# Altium project TD3_TP2_Placa-de-desarrollo.PrjPcb
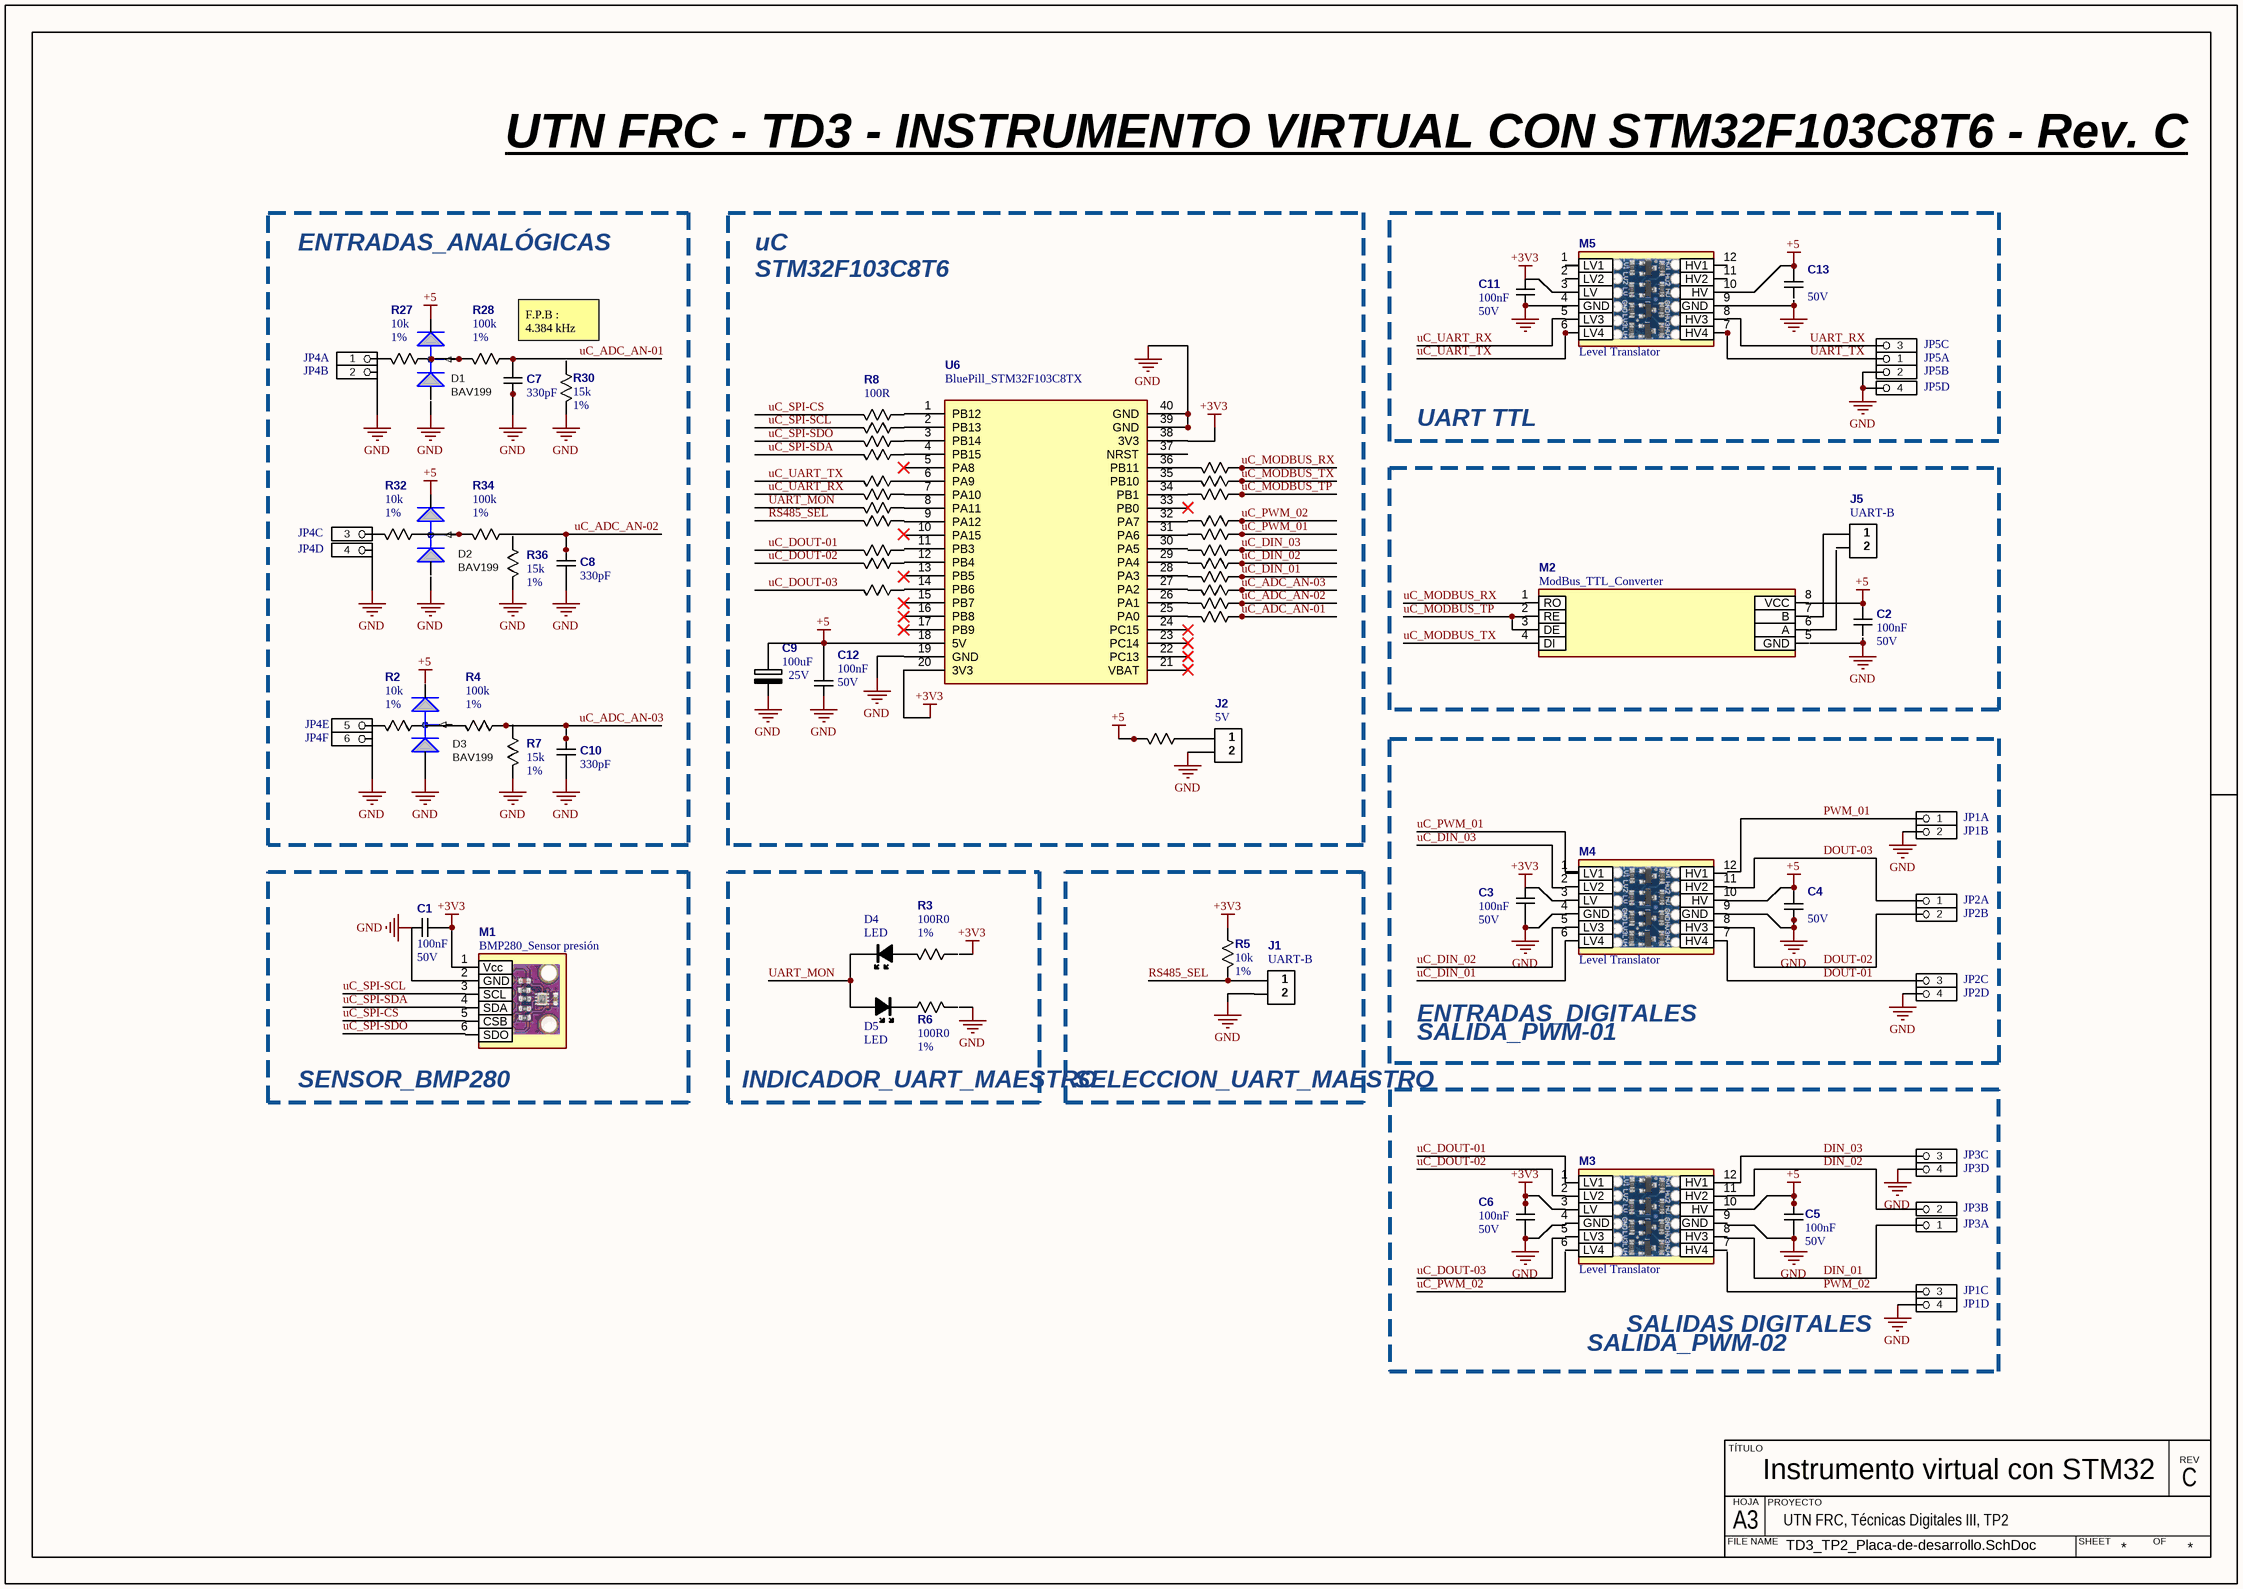
[diagram p0: TD3_TP2_Placa-de-desarrollo.SchDoc]
1 sheet, 67 parts. Net scope: global (net labels, ports and power ports of the same name join across sheets).
Board file: TD3_TP2_Placa-de-desarrollo.PcbDoc

## Sheet TD3_TP2_Placa-de-desarrollo.SchDoc: Instrumento virtual con STM32
size 420 x 297 mm; Revision: C; Proyecto: UTN FRC, Técnicas Digitales III, TP2

### Parts
C1  VALOR: 100nF  TENSION: 50V  [C_0805_RFW]  (hidden comment: Cap No Pol)
C2  VALOR: 100nF  TENSION: 50V  [C_0805_RFW]  (hidden comment: Cap No Pol)
C3  VALOR: 100nF  TENSION: 50V  [C_0805_RFW]  (hidden comment: Cap No Pol)
C4  TENSION: 50V  [C_0805_RFW]  (hidden comment: Cap No Pol)
C5  VALOR: 100nF  TENSION: 50V  [C_0805_RFW]  (hidden comment: Cap No Pol)
C6  VALOR: 100nF  TENSION: 50V  [C_0805_RFW]  (hidden comment: Cap No Pol)
C7  330pF  [C_0805_RFW]
C8  330pF  [C_0805_RFW]
C9  CAPACIDAD: 100uF  TENSION: 25V  [CAP_ELECTR_V_10x12]  (hidden comment: Cap Pol Al)
C10  330pF  [C_0805_RFW]
C11  VALOR: 100nF  TENSION: 50V  [C_0805_RFW]  (hidden comment: Cap No Pol)
C12  VALOR: 100nF  TENSION: 50V  [C_0805_RFW]  (hidden comment: Cap No Pol)
C13  TENSION: 50V  [C_0805_RFW]  (hidden comment: Cap No Pol)
D1  BAV199  [SOT_23_3_1_RFW]
D2  BAV199  [SOT_23_3_1_RFW]
D3  BAV199  [SOT_23_3_1_RFW]
D4  LED  [LED_5mm]
D5  LED  [LED_5mm]
J1  UART-B  [HEADER_2_FEMALE_2.54]
J2  5V  [HEADER_2_FEMALE_2.54]
J5  UART-B  [HEADER_2_FEMALE_2.54]
JP1  HEADER PART  [PIN_1X4_MACHO_2.54]  (value not drawn)  (parts A,B,C,D of 4)
JP2  HEADER PART  [PIN_1X4_MACHO_2.54]  (value not drawn)  (parts A,B,C,D of 4)
JP3  HEADER PART  [PIN_1X4_MACHO_2.54]  (value not drawn)  (parts A,B,C,D of 4)
JP4  HEADER PART  [PIN_1X6_MACHO_2.54]  (value not drawn)  (parts A,B,C,D,E,F of 6)
JP5  HEADER PART  [PIN_1X4_MACHO_2.54]  (value not drawn)  (parts A,B,C,D of 4)
M1  BMP280_Sensor presión  [BMP280]
M2  ModBus_TTL_Converter  [TTL_RS485_CONVERTER]
M3  Level Translator  [Level_Translator_FET]
M4  Level Translator  [Level_Translator_FET]
M5  Level Translator  [Level_Translator_FET]
R1  100R  [R_0805_RFW]  (value not drawn)
R2  10k  Tolerancia: 1%  [R_0805_RFW]
R3  100R0  Tolerancia: 1%  [R_0805_RFW]
R4  100k  Tolerancia: 1%  [R_0805_RFW]
R5  10k  Tolerancia: 1%  [R_0805_RFW]
R6  100R0  Tolerancia: 1%  [R_0805_RFW]
R7  15k  Tolerancia: 1%  [R_0805_RFW]
R8  100R  [R_0805_RFW]
R9  100R  [R_0805_RFW]  (value not drawn)
R10  100R  [R_0805_RFW]  (value not drawn)
R11  100R  [R_0805_RFW]  (value not drawn)
R12  100R  [R_0805_RFW]  (value not drawn)
R13  100R  [R_0805_RFW]  (value not drawn)
R14  100R  [R_0805_RFW]  (value not drawn)
R15  100R  [R_0805_RFW]  (value not drawn)
R16  100R  [R_0805_RFW]  (value not drawn)
R17  100R  [R_0805_RFW]  (value not drawn)
R18  100R  [R_0805_RFW]  (value not drawn)
R19  100R  [R_0805_RFW]  (value not drawn)
R20  100R  [R_0805_RFW]  (value not drawn)
R21  100R  [R_0805_RFW]  (value not drawn)
R22  100R  [R_0805_RFW]  (value not drawn)
R23  100R  [R_0805_RFW]  (value not drawn)
R24  100R  [R_0805_RFW]  (value not drawn)
R25  100R  [R_0805_RFW]  (value not drawn)
R26  100R  [R_0805_RFW]  (value not drawn)
R27  10k  Tolerancia: 1%  [R_0805_RFW]
R28  100k  Tolerancia: 1%  [R_0805_RFW]
R29  100R  [R_0805_RFW]  (value not drawn)
R30  15k  Tolerancia: 1%  [R_0805_RFW]
R31  100R  [R_0805_RFW]  (value not drawn)
R32  10k  Tolerancia: 1%  [R_0805_RFW]
R33  100R  [R_0805_RFW]  (value not drawn)
R34  100k  Tolerancia: 1%  [R_0805_RFW]
R36  15k  Tolerancia: 1%  [R_0805_RFW]
U6  BluePill_STM32F103C8TX  [BluePill_STM32F103CTX]

### Blocks framed on the sheet
ENTRADAS_ANALÓGICAS: C7 C8 C10 D1-D3 JP4 R2 R4 R7 R27 R28 R30 R32 R34 R36
UART TTL: C11 C13 JP5 M5
SENSOR_BMP280: C1 M1
INDICADOR_UART_MAESTRO: D4 D5 R3 R6
SELECCION_UART_MAESTRO: J1 R5

### Nets
+3V3: C1.1 C3.2 C6.1 C11.2 M1.1(Vcc) M3.3(LV) M5.3(LV) U6.38(3V3)
+5: C2.1 C4.1 C5.1 C9.1 C12.1 C13.1 D1.2 D2.2 M3.10(HV) M5.10(HV) R33.2
GND: C1.2 C3.1 C4.2 C5.2 C6.2 C7.1 C8.1 C10.1 C11.1 C12.2 D3.1 J1.2 J2.2 JP1.2 JP1.4 JP2.4 JP3.4 JP4.2 JP4.4 JP4.6 JP5.2 JP5.4 M1.2(GND) M4.4(GND) M4.9(GND) M5.4(GND) M5.9(GND) R7.2 R30.2 R36.2 U6.39(GND) U6.40(GND)
DIN_01: JP3.1
DIN_02: JP3.2 M3.11(HV2)
DIN_03: JP3.3 M3.12(HV1)
DOUT-01: JP2.3 M4.7(HV4)
DOUT-02: JP2.2 M4.8(HV3)
DOUT-03: JP2.1
PWM_01: JP1.1
PWM_02: JP1.3
RS485_SEL: J1.1 R5.2 R29.2
UART_MON: D4.K D5.A R31.2
UART_RX: JP5.3 M5.8(HV3)
UART_TX: JP5.1 M5.7(HV4)
uC_ADC_AN-01: C7.2 R25.1 R28.1
uC_ADC_AN-02: C8.2 R24.1 R34.1
uC_ADC_AN-03: C10.2 R1.1 R4.1
uC_DIN_01: M4.6(LV4) R22.1
uC_DIN_02: M4.5(LV3) R21.1
uC_DIN_03: R19.1
uC_DOUT-01: M3.1(LV1) R18.2
uC_DOUT-02: M3.2(LV2) R20.2
uC_DOUT-03: R23.2
uC_MODBUS_RX: M2.1(RO) R12.1
uC_MODBUS_TP: M2.2(RE) M2.3(DE) R26.1
uC_MODBUS_TX: M2.4(DI) R14.1
uC_PWM_01: R17.1
uC_PWM_02: R15.1
uC_SPI-CS: R8.2
uC_SPI-SCL: M1.3(SCL) R9.2
uC_SPI-SDA: R11.2
uC_SPI-SDO: R10.2
uC_UART_RX: M5.5(LV3) R16.2
uC_UART_TX: M5.6(LV4) R13.2
NetJ2_1: J2.1 R33.1
NetJP4_1: JP4.1 R27.2
NetR2_1: R2.1 R4.2
NetR9_1: R9.1 U6.2(PB13)
NetR10_1: R10.1 U6.3(PB14)
NetR11_1: R11.1 U6.4(PB15)
NetR12_2: R12.2 U6.36(PB11)
NetR13_1: R13.1 U6.6(PA9)
NetR14_2: R14.2 U6.35(PB10)
NetR16_1: R16.1 U6.7(PA10)
NetR24_2: R24.2 U6.26(PA1)
NetR25_2: R25.2 U6.25(PA0)
NetR26_2: R26.2 U6.34(PB1)
NetR27_1: R27.1 R28.2
NetR32_1: R32.1 R34.2

Not connected (* = marked no-connect by the designer): C2 2; C9 2; C13 2; D1 1 3; D2 1 3; D3 2 3; D4 A; D5 K; J5 1 2; JP4 3 5; M1 4(SDA) 5(CSB) 6(SDO); M2 5(GND) 6(A) 7(B) 8(VCC); M3 4(GND) 5(LV3) 6(LV4) 7(HV4) 8(HV3) 9(GND); M4 1(LV1) 2(LV2) 3(LV) 10(HV) 11(HV2) 12(HV1); M5 1(LV1) 2(LV2) 11(HV2) 12(HV1); R1 2; R2 2; R3 1 2; R5 1; R6 1 2; R7 1; R8 1; R15 2; R17 2; R18 1; R19 2; R20 1; R21 2; R22 2; R23 1; R29 1; R30 1; R31 1; R32 2; R36 1; U6 1(PB12) 5(PA8) 8(PA11) 9(PA12) 10(PA15) 11(PB3) 12(PB4) 13(PB5) 14(PB6) 15(PB7) 16(PB8) 17(PB9) 18(5V) 19(GND) 20(3V3) 21(VBAT) 22(PC13)* 23(PC14)* 24(PC15)* 27(PA2) 28(PA3) 29(PA4) 30(PA5) 31(PA6) 32(PA7) 33(PB0) 37(NRST)

### Notes on the sheet
- UTN FRC - TD3 - INSTRUMENTO VIRTUAL CON STM32F103C8T6 - Rev. C
- uC
- STM32F103C8T6
- F.P.B :
  4.384 kHz
- SALIDA_PWM-01
- ENTRADAS_DIGITALES
- SALIDAS DIGITALES
- SALIDA_PWM-02
- Labels drawn without touching a wire or pin: +3V3, +5, GND
- TÍTULO
- REV
- FILE NAME
- HOJA
- A3
- PROYECTO
- SHEET
- OF

### Library data of the parts
C1-C8 C10-C13 = CAPACITOR NP: ENCAPSULADO: *; MONTAJE: *; DIELECTRICO: *; COMPONENTE: CAPACITOR; MFR PN: *; DIGIKEY PN: *; DATASHEET: *
  C7 C8 C10: VALOR: *; TENSION: *
C9 = CAP POL: COMPONENTE: Capacitor Electrolítico; MONTAJE: INS; MFR PN: *; DIELECTRICO: Al; ENCAPSULADO: *; DIGIKEY PN: *; DATASHEET: *
D1-D3 = BAV99: Par de Diodos Serie; CODIGO: 3401; DESCRIPCION: Low leakage switching diodes, BAV199 serie 70V 250mW sot-23 smd; CLASE: 1; ENCAPSULADO: SMD; VERSION: 0
J1 J2 J5 = CONN_2: CONECTOR SMD 2 PINES; MFR PN: *; COMPONENTE: CONECTOR; DIGIKEY PN: *; DATASHEET: *; MONTAJE: SMD
JP1-JP3 JP5 = PART HEADER 4: HEADER PART 4; CODIGO: *; VERSION: *; DESCRIPCION: *; CLASE: *; ENCAPSULADO: *
JP4 = PART HEADER 6: HEADER PART 6; CODIGO: *; VERSION: *; DESCRIPCION: *; CLASE: *; ENCAPSULADO: *
M3-M5 = Level_Translator_FET: Conversor de nivel JFET
R1-R34 R36 = RESISTOR: VALOR: *; MONTAJE: *; ENCAPSULADO: *; TENSIÓN: *; COMPONENTE: RESISTOR; MFR PN: *; DIGIKEY PN: *; DATASHEET: *
U6 = BluePill_STM32F103C8TX: Placa de desarrollo BluePill
D4 D5 = LED: CODIGO: *; VERSION: *; DESCRIPCION: *; CLASE: *; ENCAPSULADO: *